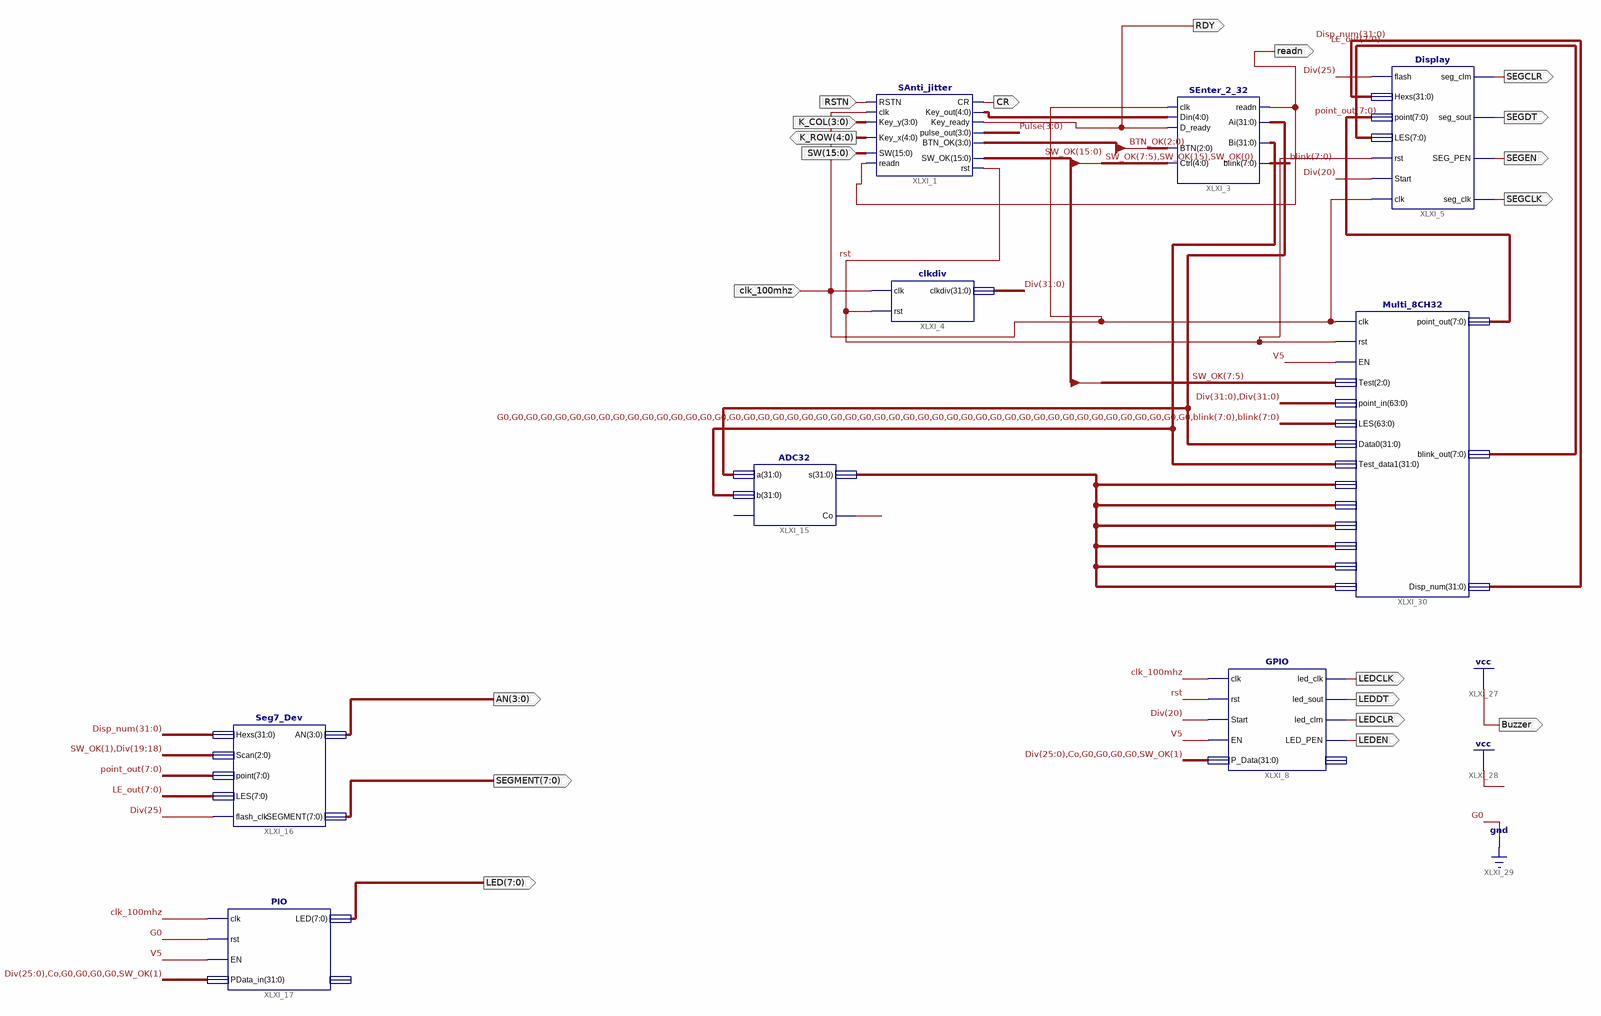
[diagram p0: schematic sheet 1]
// Xilinx ISE schematic Framework.sch (kintex7) as structural Verilog: 9 symbols, 20 ports
module Framework (
  input  clk_100mhz,
  input  RSTN,
  input  [15:0] SW,
  input  [3:0] K_COL,
  output [3:0] AN,
  output [7:0] SEGMENT,
  output [7:0] LED,
  output [4:0] K_ROW,
  output CR,
  output SEGCLR,
  output SEGDT,
  output SEGEN,
  output SEGCLK,
  output readn,
  output RDY,
  output LEDCLK,
  output LEDDT,
  output LEDCLR,
  output LEDEN,
  output Buzzer
);

  wire Co, rst;
  wire [3:0] BTN_OK, Pulse;
  wire [4:0] XLXN_23;
  wire [7:0] blink, LE_out, point_out;
  wire [15:0] SW_OK;
  wire [31:0] Ai, Bi, Disp_num, Div, XLXN_122;

  Seg7_Dev XLXI_16 (
    .Hexs(Disp_num), .Scan({SW_OK[1], Div[19:18]}), .point(point_out), .LES(LE_out), .flash_clk(Div[25]),
    .AN(AN), .SEGMENT(SEGMENT));
  PIO XLXI_17 (
    .clk(clk_100mhz), .rst(1'b0), .EN(1'b1), .PData_in({Div[25:0], Co, 4'b0000, SW_OK[1]}), .LED(LED));  // open: GPIOf0
  SAnti_jitter XLXI_1 (
    .SW(SW), .readn(readn), .Key_y(K_COL), .Key_x(K_ROW), .RSTN(RSTN), .clk(clk_100mhz), .Key_out(XLXN_23),
    .Key_ready(RDY), .CR(CR), .rst(rst), .SW_OK(SW_OK), .pulse_out(Pulse), .BTN_OK(BTN_OK));
  clkdiv XLXI_4 (.clk(clk_100mhz), .rst(rst), .clkdiv(Div));
  Display XLXI_5 (
    .flash(Div[25]), .Hexs(Disp_num), .point(point_out), .LES(LE_out), .rst(rst), .Start(Div[20]),
    .clk(clk_100mhz), .seg_clm(SEGCLR), .seg_sout(SEGDT), .SEG_PEN(SEGEN), .seg_clk(SEGCLK));
  GPIO XLXI_8 (
    .clk(clk_100mhz), .rst(rst), .Start(Div[20]), .EN(1'b1), .P_Data({Div[25:0], Co, 4'b0000, SW_OK[1]}),
    .led_clk(LEDCLK), .led_sout(LEDDT), .led_clrn(LEDCLR), .LED_PEN(LEDEN));  // open: GPIOf0
  SEnter_2_32 XLXI_3 (
    .readn(readn), .Ai(Ai), .Bi(Bi), .blink(blink), .Din(XLXN_23), .D_ready(RDY), .clk(clk_100mhz),
    .Ctrl({SW_OK[7:5], SW_OK[15], SW_OK[0]}), .BTN(BTN_OK[2:0]));
  ADC32 XLXI_15 (.a(Ai), .b(Bi), .s(XLXN_122), .Co(Co));  // open: C0
  Multi_8CH32 XLXI_30 (
    .clk(clk_100mhz), .rst(rst), .EN(1'b1), .Test(SW_OK[7:5]), .point_in({Div, Div}),
    .LES({{48{1'b0}}, blink, blink}), .Data0(Ai), .Test_data1(Bi), .Test_data2(XLXN_122),
    .Test_data3(XLXN_122), .Test_data4(XLXN_122), .Test_data5(XLXN_122), .Test_data6(XLXN_122),
    .Test_data7(XLXN_122), .point_out(point_out), .blink_out(LE_out), .Disp_num(Disp_num));

  assign Buzzer = 1'b1;
endmodule
